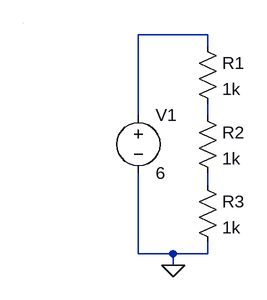
[diagram p0: schematic 1Series.asc]
1Series.asc, the LTspice schematic file:
Version 4
SHEET 1 880 680
WIRE 256 16 160 16
WIRE 256 32 256 16
WIRE 160 128 160 16
WIRE 256 128 256 112
WIRE 256 224 256 208
WIRE 160 320 160 208
WIRE 208 320 160 320
WIRE 256 320 256 304
WIRE 256 320 208 320
WIRE 208 336 208 320
WIRE 0 0 0 0
FLAG 208 336 0
SYMBOL res 240 16 R0
SYMATTR InstName R1
SYMATTR Value 1k
SYMBOL res 240 112 R0
SYMATTR InstName R2
SYMATTR Value 1k
SYMBOL res 240 208 R0
SYMATTR InstName R3
SYMATTR Value 1k
SYMBOL voltage 160 112 R0
SYMATTR InstName V1
SYMATTR Value 6

The netlist it stands for:
* 1Series.asc
R1 N001 N002 1k
R2 N002 N003 1k
R3 N003 0 1k
V1 N001 0 6
.backanno
.end